# EAGLE design HeatpumpMonitor (EAGLE 6.6.0)
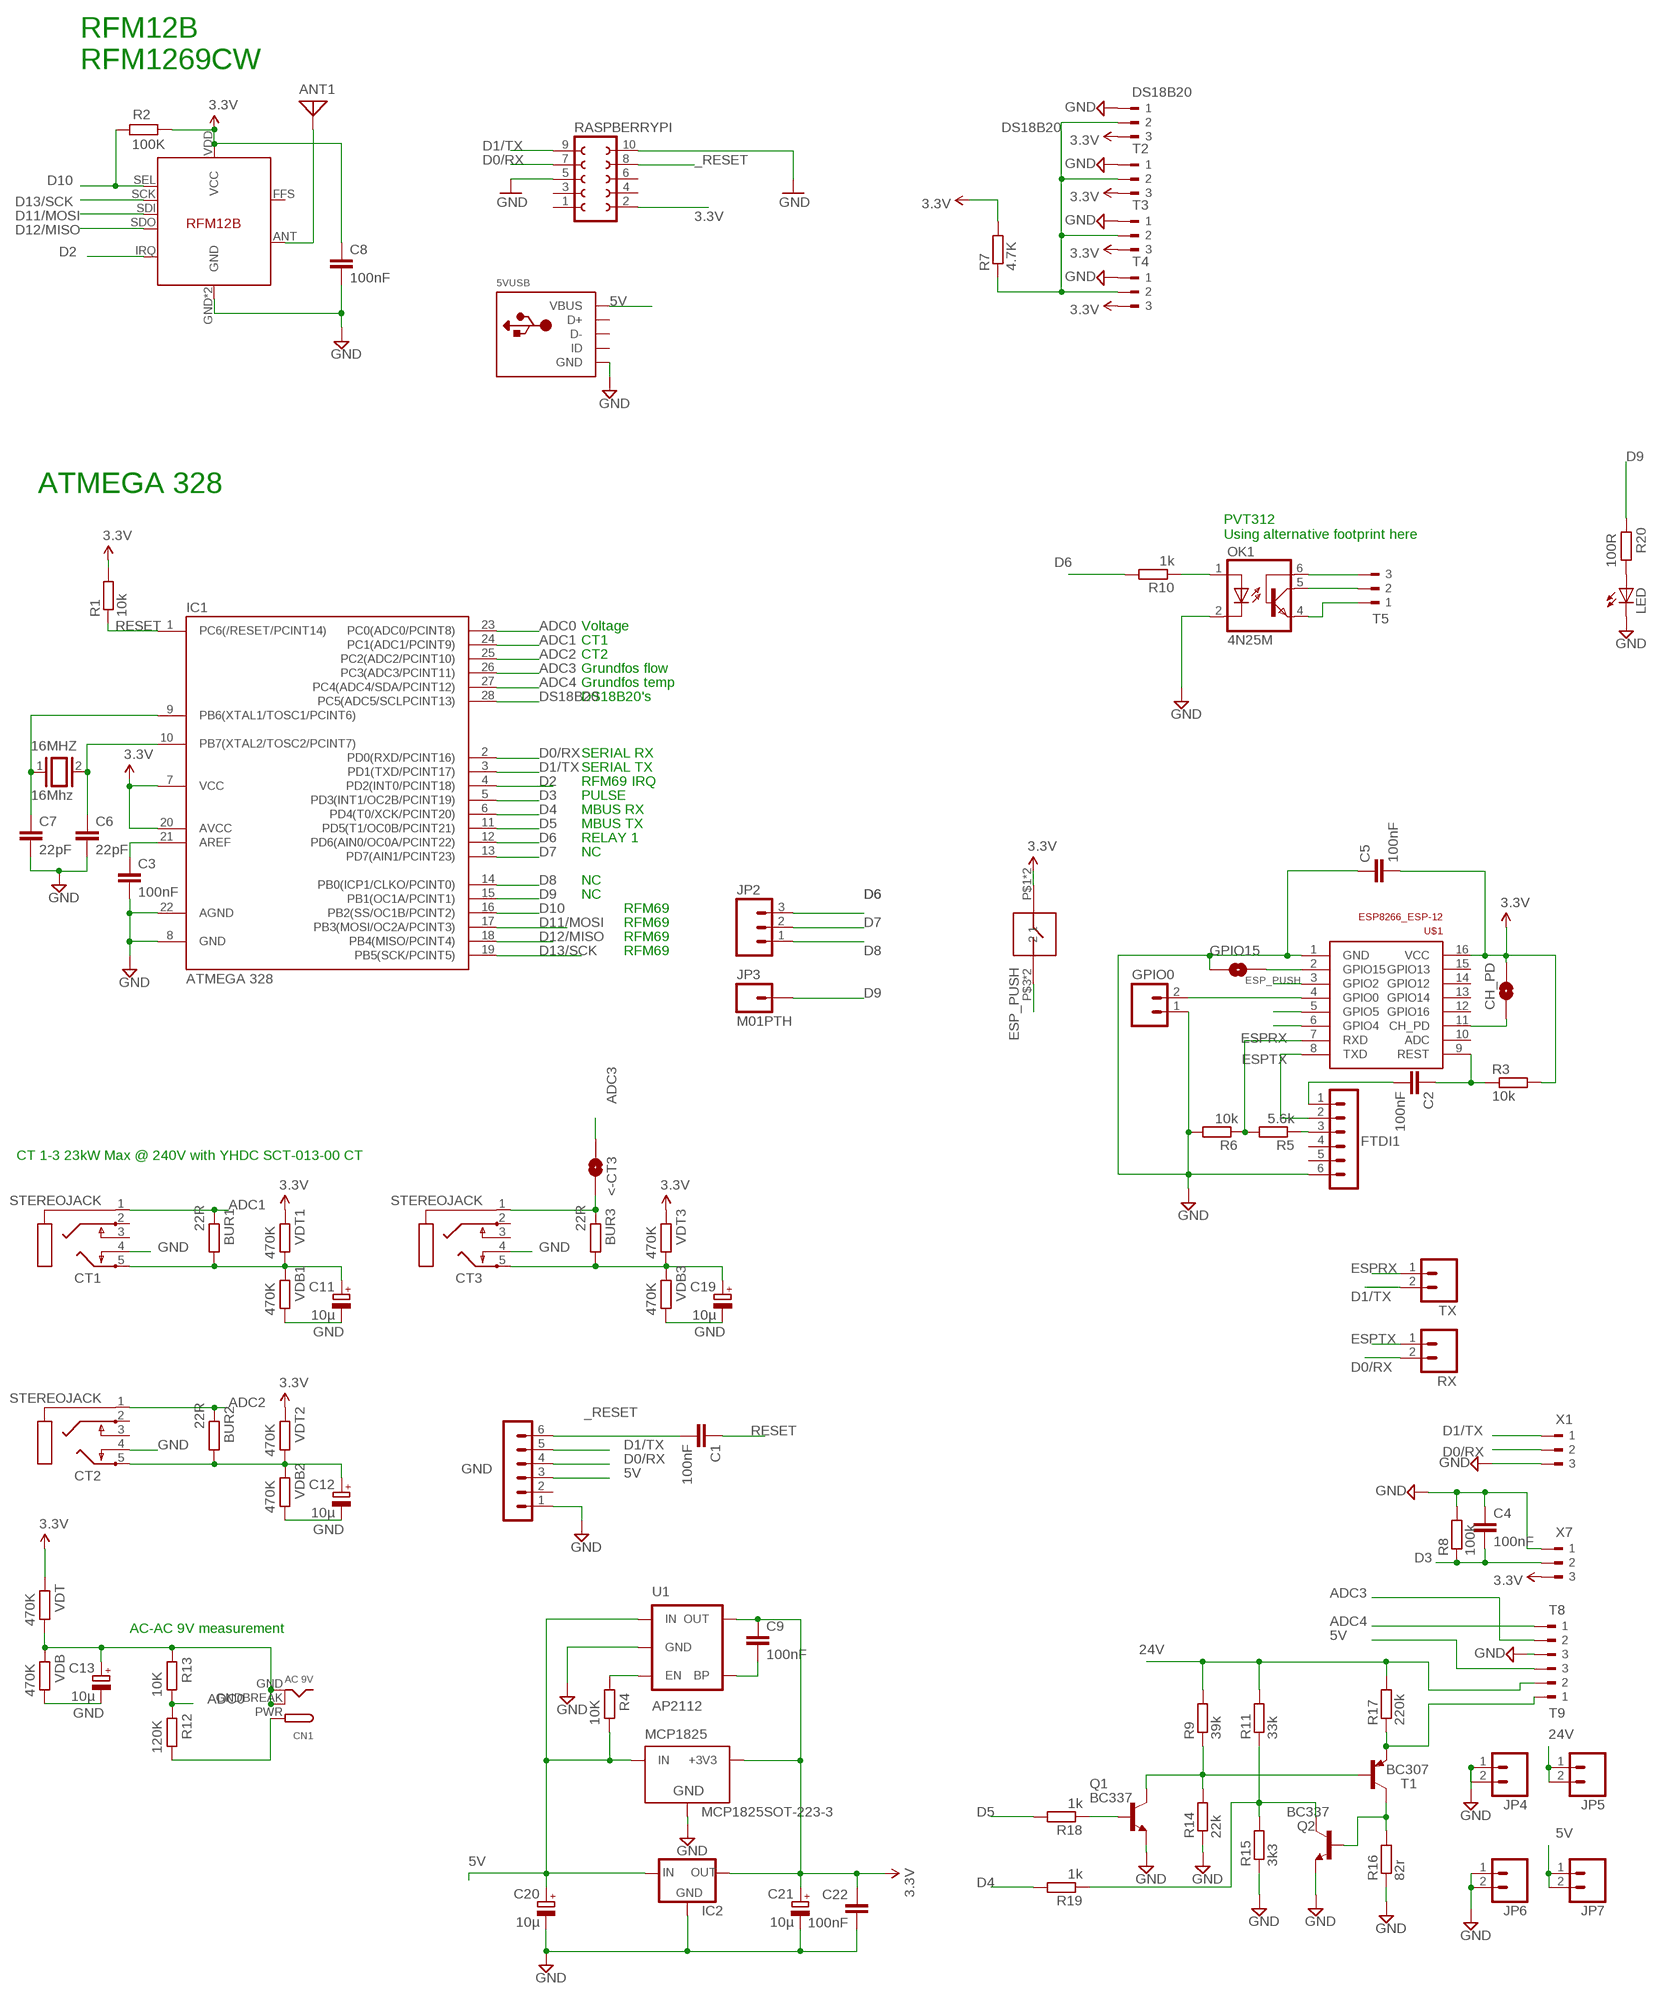
[diagram p0: schematic, sheet 1]

## Parts
5VUSB  USBMOLEX  [USB-MINIB-THM-MOLEX]
16MHZ  16Mhz  XTAL/S  [QS]
<-CT3  SOLDERJUMPERNO  [SJ_2S-NO]
ANT1  ANTENNA  [PAD-01]
BUR1  22R  R-EU_0204/7  [0204/7]
BUR2  22R  R-EU_0204/7  [0204/7]
BUR3  22R  R-EU_0204/7  [0204/7]
C1  100nF  C-EU025-024X044  [C025-024X044]
C2  100nF  C-EU025-024X044  [C025-024X044]
C3  100nF  C-EU025-024X044  [C025-024X044]
C4  100nF  C-EU025-024X044  [C025-024X044]
C5  100nF  C-EU025-024X044  [C025-024X044]
C6  22pF  C2.5/2  [C2.5-2]
C7  22pF  C2.5/2  [C2.5-2]
C8  100nF  C-EU025-024X044  [C025-024X044]
C9  100nF  C-EUC0603  [C0603]
C11  10µ  CPOL-EUE1.8-4  [E1,8-4]
C12  10µ  CPOL-EUE1.8-4  [E1,8-4]
C13  10µ  CPOL-EUE1.8-4  [E1,8-4]
C19  10µ  CPOL-EUE1.8-4  [E1,8-4]
C20  10µ  CPOL-EUE1.8-4  [E1,8-4]
C21  10µ  CPOL-EUE1.8-4  [E1,8-4]
C22  100nF  C-EU025-024X044  [C025-024X044]
CH_PD  SOLDERJUMPERNO  [SJ_2S-NO]
CN1  AC 9V  DCBARRELPTH  [DCJACK_2MM_PTH]
CT1  STEREOJACK  [STX3100]
CT2  STEREOJACK  [STX3100]
CT3  STEREOJACK  [STX3100]
DS18B20  180-3  [180-3]
FTDI1  FTDI  MA06-1  [MA06-1]
GND  FTDI  MA06-1  [MA06-1]
GPIO0  M02PTH  [1X02]
GPIO15  SOLDERJUMPERNO  [SJ_2S-NO]
IC1  ATMEGA 328  ATMEGA48/88/168-PU  [DIL28-3]
IC2  78XXS  [78XXS]
JP2  M03PTH  [1X03]
JP3  M01PTH  [1X01]
JP4  M02PTH  [1X02]
JP5  M02PTH  [1X02]
JP6  M02PTH  [1X02]
JP7  M02PTH  [1X02]
LED  LED3MM  [LED3MM]
MCP1825  MCP1825SOT-223-3  [SOT-223]
OK1  4N25M  [DIL06]
Q1  BC337  [TO92]
Q2  BC337  [TO92]
R1  10k  R-EU_0204/7  [0204/7]
R2  100K  R-EU_0204/7  [0204/7]
R3  10k  R-EU_0204/7  [0204/7]
R4  10K  R-EU_R0603  [R0603]
R5  5.6k  R-EU_0204/7  [0204/7]
R6  10k  R-EU_0204/7  [0204/7]
R7  4.7K  R-EU_0204/7  [0204/7]
R8  100k  R-EU_0207/2V  [0207/2V]
R9  39k  R-EU_0204/7  [0204/7]
R10  1k  R-EU_0204/7  [0204/7]
R11  33k  R-EU_0204/7  [0204/7]
R12  120K  R-EU_0204/7  [0204/7]
R13  10K  R-EU_0204/7  [0204/7]
R14  22k  R-EU_0204/7  [0204/7]
R15  3k3  R-EU_0204/7  [0204/7]
R16  82r  R-EU_0204/7  [0204/7]
R17  220k  R-EU_0204/7  [0204/7]
R18  1k  R-EU_0204/7  [0204/7]
R19  1k  R-EU_0204/7  [0204/7]
R20  100R  R-EU_0204/7  [0204/7]
RASPBERRYPI  FE05-2  [FE05-2]
RX  M02PTH  [1X02]
T1  BC307  [TO92]
T2  180-3  [180-3]
T3  180-3  [180-3]
T4  180-3  [180-3]
T5  180-3  [180-3]
T8  180-3  [180-3]
T9  180-3  [180-3]
TX  M02PTH  [1X02]
U1  AP2112  V_REG_LDOSMD  [SOT23-5]
U$1  ESP8266_ESP-12  [ESP8266-ESP12]
U$2  KSEK43G"  [KSEK43G]
U$14  RFM12B  [RFM12B]
VDB  470K  R-EU_0204/7  [0204/7]
VDB1  470K  R-EU_0204/7  [0204/7]
VDB2  470K  R-EU_0204/7  [0204/7]
VDB3  470K  R-EU_0204/7  [0204/7]
VDT  470K  R-EU_0204/7  [0204/7]
VDT1  470K  R-EU_0204/7  [0204/7]
VDT2  470K  R-EU_0204/7  [0204/7]
VDT3  470K  R-EU_0204/7  [0204/7]
X1  180-3  [180-3]
X7  180-3  [180-3]

## Nets
3.3V: C5.2 C8.1 C9.1 C21.+ C22.1 CH_PD.1 DS18B20.3 IC1.7(VCC) IC1.20(AVCC) IC2.OUT MCP1825.3(+3V3) R1.2 R2.1 R3.2 R7.2 RASPBERRYPI.2 T2.3 T3.3 T4.3 U1.5(OUT) U$1.16(VCC) U$2.P$1 U$2.P$2 U$14.VDD(VCC) VDT1.2 VDT2.2 VDT3.2 VDT.2 X7.3
5V [power]: 5VUSB.VBUS C20.+ GND.3 IC2.IN JP7.1 JP7.2 MCP1825.1(IN) R4.1 T9.3 U1.1(IN)
24V: JP5.1 JP5.2 R9.2 R11.2 R17.2 T9.2
_RESET: C1.2 GND.6 RASPBERRYPI.8
AC: CN1.PWR R12.1
ADC0: IC1.23(PC0(ADC0/PCINT8)) R12.2 R13.1
ADC1: BUR1.2 CT1.1 IC1.24(PC1(ADC1/PCINT9))
ADC2: BUR2.2 CT2.1 IC1.25(PC2(ADC2/PCINT10))
ADC3: <-CT3.2 IC1.26(PC3(ADC3/PCINT11)) T8.2
ADC4: IC1.27(PC4(ADC4/SDA/PCINT12)) T8.1
D0/RX: GND.4 IC1.2(PD0(RXD/PCINT16)) RASPBERRYPI.7 RX.2 X1.2
D1/TX: GND.5 IC1.3(PD1(TXD/PCINT17)) RASPBERRYPI.9 TX.2 X1.1
D2: IC1.4(PD2(INT0/PCINT18)) U$14.IRQ
D3: C4.2 IC1.5(PD3(INT1/OC2B/PCINT19)) R8.1 X7.2
D4: IC1.6(PD4(T0/XCK/PCINT20)) R19.2
D5: IC1.11(PD5(T1/OC0B/PCINT21)) R18.2
D6: IC1.12(PD6(AIN0/OC0A/PCINT22)) JP2.3 R10.2
D7: IC1.13(PD7(AIN1/PCINT23)) JP2.2
D8: IC1.14(PB0(ICP1/CLKO/PCINT0)) JP2.1
D9: IC1.15(PB1(OC1A/PCINT1)) JP3.1 R20.2
D10: IC1.16(PB2(SS/OC1B/PCINT2)) R2.2 U$14.SEL
D11/MOSI: IC1.17(PB3(MOSI/OC2A/PCINT3)) U$14.SDI
D12/MISO: IC1.18(PB4(MISO/PCINT4)) U$14.SDO
D13/SCK: IC1.19(PB5(SCK/PCINT5)) U$14.SCK
DIG1: ANT1.1 U$14.ANT
DS18B20: DS18B20.2 IC1.28(PC5(ADC5/SCLPCINT13)) R7.1 T2.2 T3.2 T4.2
ESP_PUSH: U$1.3(GPIO2) U$2.P$3 U$2.P$4
ESPRX: R5.2 R6.1 TX.1 U$1.7(RXD)
ESPTX: FTDI1.2 RX.1 U$1.8(TXD)
GND [power]: 5VUSB.GND C3.2 C4.1 C5.1 C6.2 C7.2 C8.2 C11.- C12.- C13.- C19.- C20.- C21.- C22.2 CT1.4 CT2.4 CT3.4 DS18B20.1 FTDI1.6 GND.1 GPIO0.1 GPIO15.2 IC1.8(GND) IC1.22(AGND) IC2.GND JP4.1 JP4.2 JP6.1 JP6.2 LED.K(C) MCP1825.2(GND) OK1.2(C) Q1.1(E) Q2.1(E) R6.2 R8.2 R14.1 R15.1 R16.1 RASPBERRYPI.5 RASPBERRYPI.10 T2.1 T3.1 T4.1 T8.3 U1.2(GND) U$1.1(GND) U$14.GND U$14.P$12(GND) VDB1.1 VDB2.1 VDB3.1 VDB.1 X1.3 X7.1
N$1: 16MHZ.2 C6.1 IC1.10(PB7(XTAL2/TOSC2/PCINT7))
N$2: BUR2.1 C12.+ CT2.5 VDB2.2 VDT2.1
N$3: C2.2 FTDI1.1
N$4: <-CT3.1 BUR3.2 CT3.1
N$5: OK1.1(A) R10.1
N$6: OK1.6(BAS) T5.3
N$7: C9.2 U1.4(BP)
N$8: BUR3.1 C19.+ CT3.5 VDB3.2 VDT3.1
N$9: OK1.5(COL) T5.2
N$10: OK1.4(EMI) T5.1
N$11: R4.2 U1.3(EN)
N$12: 16MHZ.1 C7.1 IC1.9(PB6(XTAL1/TOSC1/PCINT6))
N$13: R17.1 T1.1(E) T9.1
N$14: U$1.5(GPIO5)
N$15: LED.A R20.1
N$16: Q2.2(B) R16.2 T1.3(C)
N$17: U$1.6(GPIO4)
N$18: Q1.3(C) R9.1 R14.2 T1.2(B)
N$19: C3.1 IC1.21(AREF)
N$21: Q2.3(C) R11.1 R15.2 R19.1
N$25: Q1.2(B) R18.1
N$26: GPIO15.1 U$1.2(GPIO15)
N$29: GPIO0.2 U$1.4(GPIO0)
N$34: C13.+ CN1.GND CN1.GNDBREAK R13.2 VDB.2 VDT.1
N$36: FTDI1.3 R5.1
N$38: BUR1.1 C11.+ CT1.5 VDB1.2 VDT1.1
N$39: CH_PD.2 U$1.11(CH_PD)
N$40: C2.1 R3.1 U$1.9(REST)
RESET: C1.1 IC1.1(PC6(/RESET/PCINT14)) R1.1
Unconnected: 5VUSB.D+ 5VUSB.D- 5VUSB.ID CT1.2 CT1.3 CT2.2 CT2.3 CT3.2 CT3.3 FTDI1.4 FTDI1.5 GND.2 RASPBERRYPI.1 RASPBERRYPI.3 RASPBERRYPI.4 RASPBERRYPI.6 U$1.10(ADC) U$1.12(GPIO16) U$1.13(GPIO14) U$1.14(GPIO12) U$1.15(GPIO13) U$14.FFS

## Notes on the sheet
- RFM12B
  RFM1269CW
- ATMEGA 328
- PVT312
  Using alternative footprint here
- Voltage
- CT1
- CT2
- Grundfos flow
- Grundfos temp
- DS18B20's
- SERIAL RX
- SERIAL TX
- RFM69 IRQ
- PULSE
- MBUS RX
- MBUS TX
- RELAY 1
- NC
- NC
- NC
- RFM69
- RFM69
- RFM69
- RFM69
- CT 1-3 23kW Max @ 240V with YHDC SCT-013-00 CT
- AC-AC 9V measurement

## Library data of the parts
5VUSB = adafruit:USB: USB Connectors USBMINIB - Surface Mount Female Mini-B USB Connector 4UConnector: 06564 By microbuilder.eu Thru-hole RA Female Mini-B USB Connector 4UConnector: 18732 By ladyada.net
16MHZ = special:XTAL/S: CRYSTAL
<-CT3 CH_PD GPIO15 = SparkFun:SOLDERJUMPER: Solder Jumper Standard SMD solder jumper. Used to automate production. Two varients : Normally Open and Normally Closed are the same, but have different paste layers. NC will have a large amount of paste and should jumper during reflow.
ANT1 = discrete:ANTENNA: Antenna
BUR1-BUR3 R2-R6 R8 R10 R12 R13 R20 VDB VDB1-VDB3 VDT VDT1-VDT3 = rcl:R-EU_: RESISTOR, European symbol
C1-C5 C8 C9 C22 = resistor:C-EU: CAPACITOR, European symbol
C6 C7 = capacitor-wima:C: CAPACITOR naming: grid - package width
C11-C13 C19-C21 = resistor:CPOL-EU: POLARIZED CAPACITOR, European symbol
CN1 = adafruit:DCBARREL: 2.0mm DC Barrel Jack DCJACK_2MM_PTH - Through Hole Jack (4UConnector: 05537)
CT1-CT3 = adafruit:STEREOJACK: MIC/HEADPHONE JACK Stereo jack with two switches. Kycon STX3100, CUI SJ1-3555NG and/or 4UCon 05544
DS18B20 T2-T5 T8 T9 X1 X7 = con-weidmueller-sl35:180-3: WEIDMUELLER CLAMP CONNECTOR; OC_FARNELL: unknown; OC_NEWARK: unknown
FTDI1 GND = JeeLabs:MA06-1: PIN HEADER
GPIO0 JP4-JP7 RX TX = SparkFun:M02: Header 2 Standard 2-pin 0.1" header. Use with straight break away headers (SKU : PRT-00116), right angle break away headers (PRT-00553), swiss pins (PRT-00743), machine pins (PRT-00117), and female headers (PRT-00115). Molex polarized connector foot print use with SKU : PRT-08233 with associated crimp pins and housings.
IC1 = atmega8:ATMEGA48/88/168-PU
IC2 = v-reg:78XXS: VOLTAGE REGULATOR
JP2 = SparkFun:M03: Header 3 Standard 3-pin 0.1" header. Use with straight break away headers (SKU : PRT-00116), right angle break away headers (PRT-00553), swiss pins (PRT-00743), machine pins (PRT-00117), and female headers (PRT-00115). Molex polarized connector foot print use with SKU : PRT-08232 with associated crimp pins and housings.
JP3 = SparkFun:M01: Header 1 Standard 1-pin 0.1" header. Use with straight break away headers (SKU : PRT-00116), right angle break away headers (PRT-00553), swiss pins (PRT-00743), machine pins (PRT-00117), and female headers (PRT-00115).
LED = adafruit:LED: LED OSRAM: - CHIPLED LG R971, LG N971, LY N971, LG Q971, LY Q971, LO R971, LY R971 LH N974, LH R974 LS Q976, LO Q976, LY Q976 LO Q996 - Hyper CHIPLED LW Q18S LB Q993, LB Q99A, LB R99A - SideLED LS A670, LO A670, LY A670, LG A670, LP A670 LB A673, LV A673, LT A673, LW A673 LH A674 LY A675 LS A676, LA A676, LO A676, LY A676, LW A676 LS A679, LY A679, LG A679 - Hyper Micro SIDELED® LS Y876, LA Y876, LO Y876, LY Y876 LT Y87S - SmartLED LW L88C, LW L88S LB L89C, LB L89S, LG L890 LS L89K, LO L89K, LY L89K LS L896, LA L896, LO L896, LY L896 - TOPLED LS T670, LO T670, LY T670, LG T670, LP T670 LSG T670, LSP T670, LSY T670, LOP T670, LYG T670 LG T671, LOG T671, LSG T671 LB T673, LV T673, LT T673, LW T673 LH T674 LS T676, LA T676, LO T676, LY T676, LB T676, LH T676, LSB T676, LW T676 LB T67C, LV T67C, LT T67C, LS T67K, LO T67K, LY T67K, LW E67C LS E67B, LA E67B, LO E67B, LY E67B, LB E67C, LV E67C, LT E67C LW T67C LS T679, LY T679, LG T679 LS T770, LO T770, LY T770, LG T770, LP T770 LB T773, LV T773, LT T773, LW T773 LH T774 LS E675, LA E675, LY E675, LS T675 LS T776, LA T776, LO T776, LY T776, LB T776 LHGB T686 LT T68C, LB T68C - Hyper Mini TOPLED® LB M676 - Mini TOPLED Santana® LG M470 LS M47K, LO M47K, LY M47K Source: http://www.osram.convergy.de/
MCP1825 = SteelCaveRobotics-Power:MCP1825: MCP1825 3.3v LDO Linear Regulator
OK1 = optocoupler:4N*?M: General Purpose 6-Pin Phototransistor Optocouplers Source: http://www.fairchildsemi.com/ds/4N/4N35-M.pdf; MPN: 4N25-M; OC_FARNELL: 1021349; OC_NEWARK: 98K9084
Q1 Q2 = transistor:BC337: NPN TRANSISTOR
R1 R7 R9 R11 R14-R19 = resistor:R-EU_: RESISTOR, European symbol
RASPBERRYPI = con-lsta:FE05-2: FEMALE HEADER; OC_FARNELL: unknown; OC_NEWARK: unknown
T1 = transistor-pnp:BC307: PNP Transistor
U1 = SparkFun:V_REG_LDO: Voltage Regulator LDO Standard 150mA LDO voltage regulator in SOT-23 layout. Micrel part MIC5205. BP (by-pass) pin is used to lower output noise with 470pF cap.
U$1 = ESP8266-ESP12:ESP8266_ESP-12
U$2 = KSEM43G Tactile Switch:KSEK43G; TYPE: TACTILE PUSH SWITCH
U$14 = JeeParts:RFM12B

## Net classes
0 default: width 0.203 mm, drill 0.6 mm, clearance 0.203 mm
1 power: width 0.381 mm, drill 0.6 mm, clearance 0.254 mm
2 gnd: width 0.254 mm, drill 0.6 mm, clearance 0.254 mm

## Board
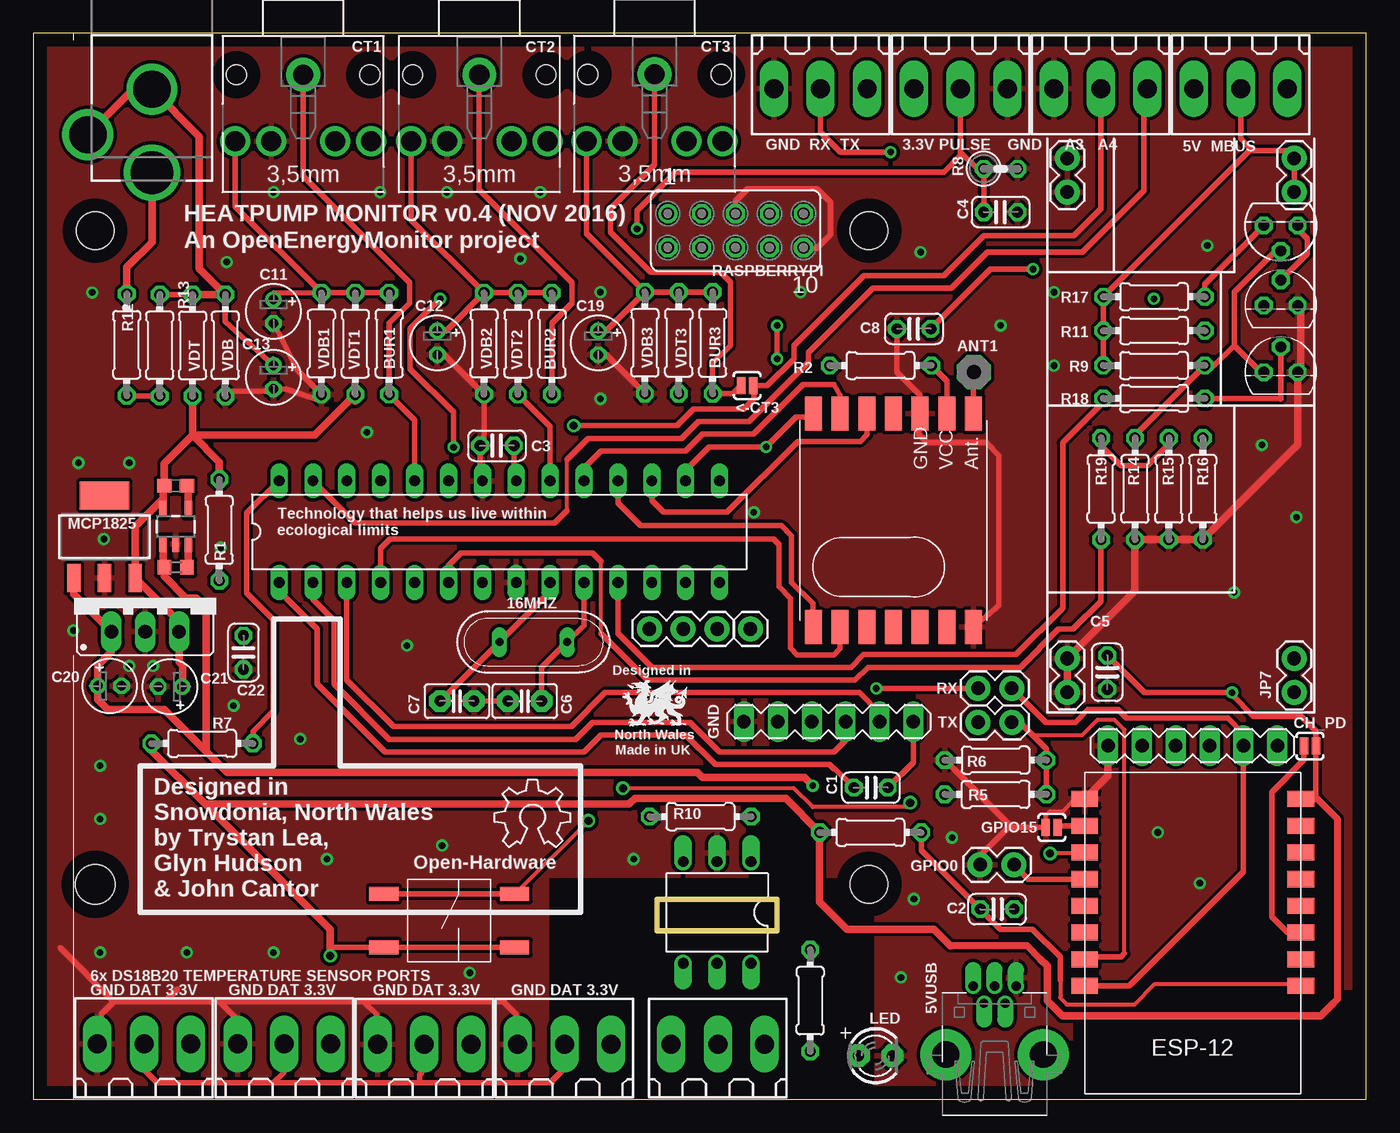
[diagram p1: board, top side]
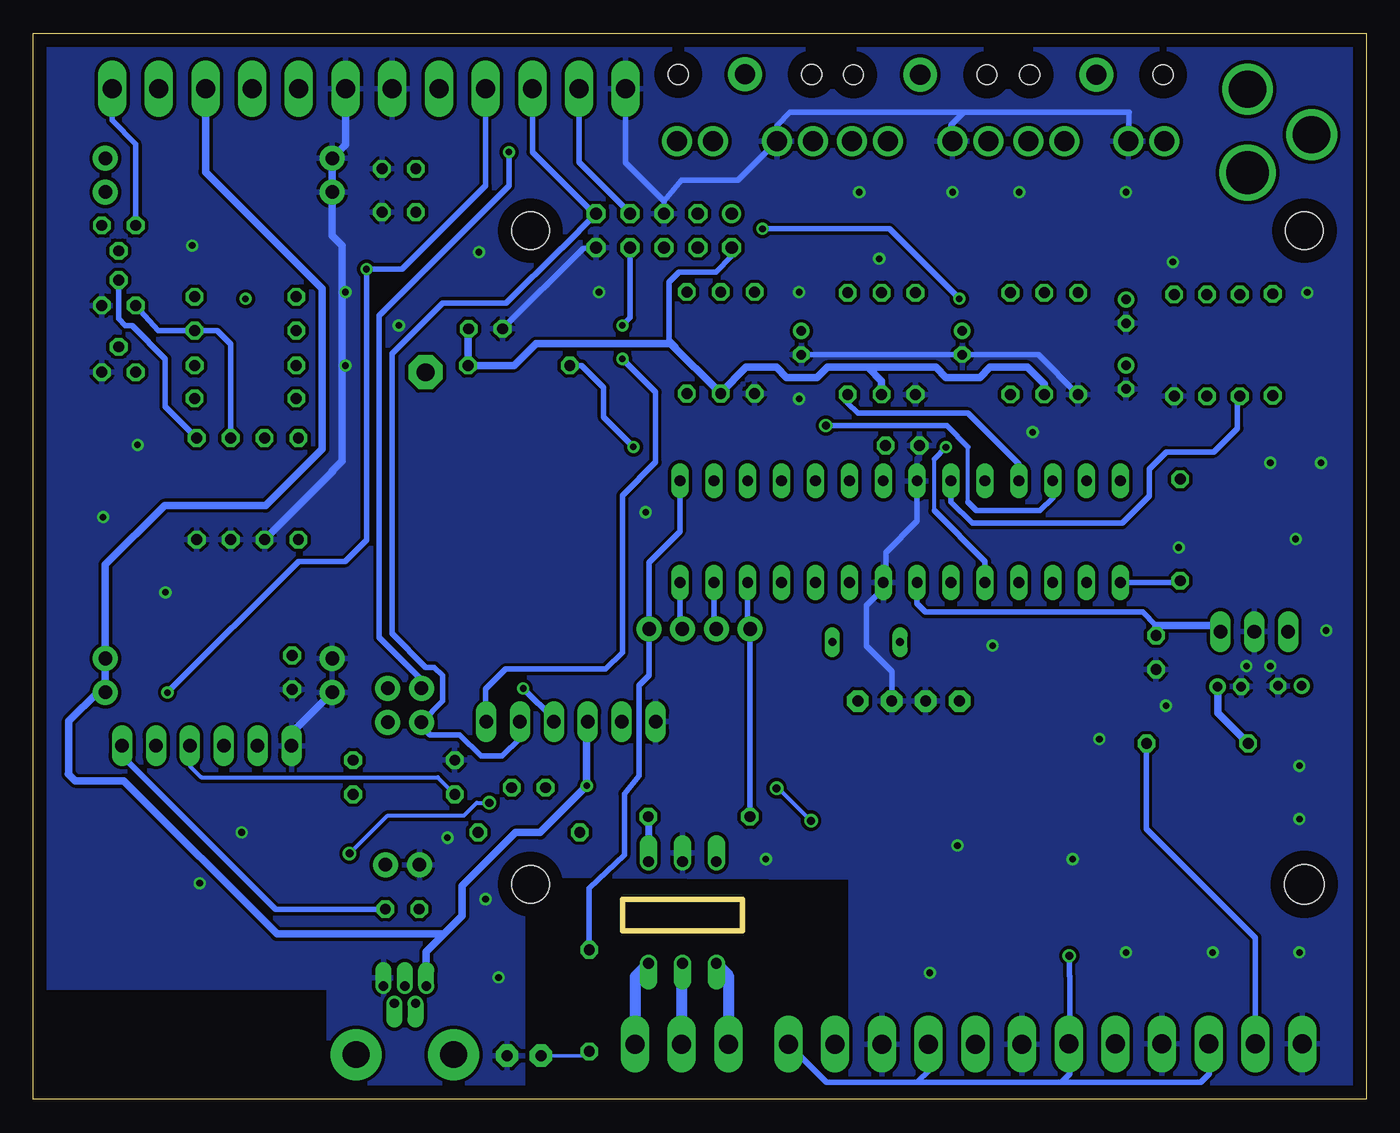
[diagram p2: board, bottom side, seen from below]

Size 99.9 x 79.9 mm. Coordinates in mm from the lower left corner, seen from the top.
Outline: 99.9,0 99.9,79.9 0,79.9 0,0 99.9,0
Copper layers (1*16): Top 0.035mm / dielectric 1.5mm / Bottom 0.035mm
Design rules "default *": minimum track width 10mil, minimum drill 24mil, track to track 8mil, track to pad 8mil, pad to pad 8mil, via to via 8mil, smd to smd 8mil, copper to edge 40mil, drill to drill 8mil, minimum pad ring 10mil, minimum via ring 8mil, stop-mask expansion 0.075mm, vias tented up to drill 0.6mm, thermal gap 10mil
Holes 2.8 mm at 62.63,16.11 62.63,65.11 4.63,65.11
Holes 3 mm at 4.63,16.11
Milling: 5 lines

### Footprints (pad centres in the part's own frame; a part is rotated, then mirrored left to right if it is on the bottom)
USB-MINIB-THM-MOLEX = drill 0.7 offset: D+ 0,9.72; D- -0.8,8.42; GND 1.6,9.72; ID 0.8,8.42; VBUS -1.6,9.72 | drill 2 pad 3.81: GND1 -3.65,4.57; GND4 3.65,4.57
QS = drill 0.61 long: 1 -2.54,0; 2 2.54,0
SJ_2S-NO = smd 0.635 x 1.27: 1 -0.45,0; 2 0.45,0
PAD-01 = drill 1.321 pad 2.54 octagon: 1 0,0
0204/7 = drill 0.813 octagon: 1 -3.81,0; 2 3.81,0
C025-024X044 = drill 0.813 octagon: 1 -1.27,0; 2 1.27,0
C2.5-2 = drill 0.813 pad 1.6 octagon: 1 -1.27,0; 2 1.27,0
C0603 = smd 1.1 x 1: 1 -0.85,0; 2 0.85,0
E1,8-4 = drill 0.711 pad 1.168: + -0.889,0 | drill 0.711 pad 1.168 octagon: - 0.889,0
DCJACK_2MM_PTH = drill 2.8: GND 0,7.35; GNDBREAK 4.8,10.75 | drill 3.2: PWR 0,13.6
STX3100 = drill 1.5 pad 2.54: 1 2.7,-0.1 | drill 1.5: 2 7.7,5; 3 7.7,2.3; 4 7.7,-2.5; 5 7.7,-5.2 | hole 1.5: 2.7,4.9; 2.7,-5.1
180-3 = drill 1.422 long: 1 -3.5,0; 2 0,0; 3 3.5,0
MA06-1 = drill 1.016 long: 1 0,0; 2 2.54,0; 3 5.08,0; 4 7.62,0; 5 10.16,0; 6 12.7,0
1X02 = drill 1.016 pad 1.88: 1 0,0; 2 2.54,0
DIL28-3 = drill 0.813 long: 1 -16.51,-3.81; 2 -13.97,-3.81; 3 -11.43,-3.81; 4 -8.89,-3.81; 5 -6.35,-3.81; 6 -3.81,-3.81; 7 -1.27,-3.81; 8 1.27,-3.81; 9 3.81,-3.81; 10 6.35,-3.81; 11 8.89,-3.81; 12 11.43,-3.81; 13 13.97,-3.81; 14 16.51,-3.81; 15 16.51,3.81; 16 13.97,3.81; 17 11.43,3.81; 18 8.89,3.81; 19 6.35,3.81; 20 3.81,3.81; 21 1.27,3.81; 22 -1.27,3.81; 23 -3.81,3.81; 24 -6.35,3.81; 25 -8.89,3.81; 26 -11.43,3.81; 27 -13.97,3.81; 28 -16.51,3.81
78XXS = drill 1.016 long: GND 0,-2.54; IN -2.54,-2.54; OUT 2.54,-2.54
1X03 = drill 1.016 pad 1.88: 1 0,0; 2 2.54,0; 3 5.08,0
1X01 = drill 1.016 pad 1.88: 1 0,0
LED3MM = drill 0.813 pad 1.676 octagon: A -1.27,0; K 1.27,0
SOT-223 = smd 1 x 2.1: 1 -2.3,-3.1; 2 0,-3.1; 3 2.3,-3.1 | smd 3.7 x 2.1: 4 0,3.1
DIL06 = drill 0.813 offset: 1 -2.54,-3.81; 2 0,-3.81; 3 2.54,-3.81; 4 2.54,3.81; 5 0,3.81; 6 -2.54,3.81
TO92 = drill 0.813 octagon: 1 1.27,0; 2 0,1.905; 3 -1.27,0
R0603 = smd 1 x 1.1: 1 -0.85,0; 2 0.85,0
0207/2V = drill 0.813 octagon: 1 -1.27,0; 2 1.27,0
FE05-2 = drill 0.914: 1 -5.08,1.27 | drill 0.914 octagon: 2 -5.08,-1.27; 3 -2.54,1.27; 4 -2.54,-1.27; 5 0,1.27; 6 0,-1.27; 7 2.54,1.27; 8 2.54,-1.27; 9 5.08,1.27; 10 5.08,-1.27
SOT23-5 = smd 0.55 x 1.2: 1 -0.95,-1.3; 2 0,-1.3; 3 0.95,-1.3; 4 0.95,1.3; 5 -0.95,1.3
ESP8266-ESP12 = smd 2 x 1.2: 1 16.2,2; 2 16.2,4; 3 16.2,6; 4 16.2,8; 5 16.2,10; 6 16.2,12; 7 16.2,14; 8 16.2,16; 9 0,16; 10 0,14; 11 0,12; 12 0,10; 13 0,8; 14 0,6; 15 0,4; 16 0,2
KSEK43G = smd 2.184 x 1.067: P$1 8,1.1; P$2 -1.8,1.1; P$3 -1.8,5.1; P$4 8,5.1
RFM12B = smd 2.54 x 1.27: ANT 8,-6; FFS -8,2; GND 8,-2; IRQ -8,4; P$8 -8,0; P$9 -8,-2; P$10 -8,-4; P$12 -8,-6; P$16 8,0; SCK 8,4; SDI 8,2; SDO -8,6; SEL 8,6; VDD 8,-4

### Placement (x,y rotation side)
5VUSB  72.05,-1.23 0 top
16MHZ  37.48,34.27 0 top
<-CT3  53.5,53.5 0 top
ANT1  70.5,54.5 270 top
BUR1  26.67,56.64 270 top
BUR2  38.86,56.64 270 top
BUR3  50.91,56.7 270 top
C1  62.78,23.36 0 top
C2  72.25,14.25 0 top
C3  34.75,49 180 top
C4  72.5,66.5 180 top
C5  80.5,32 90 top
C6  36.83,29.84 180 top
C7  31.75,29.84 0 top
C8  66,57.75 180 top
C9  10.67,45.97 0 top
C11  18,59.06 270 top
C12  30.28,56.7 270 top
C13  18,54.12 270 top
C19  42.34,56.7 270 top
C20  5.72,30.98 0 top
C21  10.25,30.93 180 top
C22  15.75,33.49 270 top
CH_PD  95.69,26.47 180 top
CN1  8.89,83.06 180 top
CT1  20.32,79.5 270 top
CT2  33.53,79.5 270 top
CT3  46.66,79.53 270 top
DS18B20  8.3,4.15 0 top
FTDI1  93.25,26.5 180 top
GND  53.26,28.3 0 top
GPIO0  70.96,17.58 0 top
GPIO15  76.34,20.38 180 top
IC1  34.92,42.55 0 top
IC2  8.38,37.59 0 top
JP2  51.25,35.25 180 top
JP3  53.75,35.25 0 top
JP4  77.5,68 90 top
JP5  94.5,68 90 top
JP6  77.5,30.5 90 top
JP7  94.5,30.5 90 top
LED  63.12,3.26 0 top
LOGO1  OSHW_LOGO_6MILX0200-NT  [OSHW_6X200_NOTEXT]  34.58,18.88 0 top
MCP1825  5.33,42.16 0 top
OK1  51.25,14 180 top
Q1  93.5,54.5 0 top
Q2  93.5,59.5 0 top
R1  13.94,42.67 90 top
R2  63.5,55 180 top
R3  62.75,20 180 top
R4  10.67,39.88 0 top
R5  72.12,22.85 0 top
R6  72.12,25.42 180 top
R7  12.65,26.67 180 top
R8  72.5,69.75 0 top
R9  84,55 180 top
R10  50,21.18 180 top
R11  84,57.62 180 top
R12  7,56.56 270 top
R13  9.47,56.51 90 top
R14  82.58,45.76 90 top
R15  85.11,45.76 90 top
R16  87.66,45.76 90 top
R17  84,60.16 180 top
R18  84,52.53 180 top
R19  80.03,45.76 270 top
R20  58.23,7.39 90 top
RASPBERRYPI  52.63,65.11 0 top
RX  73.34,30.8 180 top
T1  93.5,65.5 180 top
T2  18.8,4.15 0 top
T3  29.3,4.13 0 top
T4  39.8,4.13 0 top
T5  51.3,4.13 0 top
T8  80,75.75 180 top
T9  90.5,75.75 180 top
TX  73.34,28.26 180 top
U1  10.67,42.93 0 top
U$1  95,24.5 180 top
U$2  28.07,10.29 0 top
U$14  64.47,43.39 90 top
VDB  14.39,56.51 90 top
VDB1  21.59,56.64 90 top
VDB2  33.78,56.64 90 top
VDB3  45.84,56.7 90 top
VDT  11.93,56.51 270 top
VDT1  24.13,56.64 270 top
VDT2  36.32,56.64 270 top
VDT3  48.38,56.7 270 top
X1  59,75.75 180 top
X7  69.5,75.75 180 top

### Tracks (layer width: path | path; a pad name or v marks a point on that pad's centre or on a via)
3.3V  (via drill 0.5, 0.6)
  Top 0.406: U$1.16 arc-90 U$1.16 95,22.61 94.74,22.61 | 95.24,22.74 U$1.16 | VDT2.2 38.73,50.42 IC1.20 | R2.1 68.47,53.84 U$14.VDD 68.54,51.08 68.58,51.12 | C8.1 71.75,62.23 v74.93,62.23 74.93,62.3 | U$1.16 95.25,22.5 95.5,22.25 95.77,22.25 96.14,22.61 CH_PD.1 96.14,27.61 95.05,28.7 91.44,28.7 89.85,30.29 v89.85,30.48 83.29,30.48 C5.2 | 58.75,20 R3.2 | 22.25,11.39 U$2.P$2 U$2.P$1
  Top 0.508: 96.14,22.61 97.75,21 97.75,7.5 97.44,7.19 | 75.5,10.5 74.5,11.5 68.75,11.5
  Top 0.559: 12.88,22.12 8.84,26.16 R7.2 | 12.88,22.12 22.25,12.75 22.25,11.39 v22.25,10.75 | 68.75,11.5 67.5,12.75 61,12.75 58.94,14.81 R3.2 56.4,22.54 45.09,22.54 44.67,22.12 12.88,22.12 | 75.5,10.5 76,10 76,7.38 77.12,6.25 96.5,6.25 97.44,7.19 | U1.5 9.72,45.02 | 9.72,45.02 9.72,45.87 C9.1 9.82,47.66 11.93,49.78 | 9.72,45.02 7.63,42.94 MCP1825.3 10.92,35.78 IC2.OUT 10.92,32.77 11.18,32.51 11.18,30.71 C21.+ | 24.13,52.32 VDT1.2 21.07,49.78 11.93,49.78 | VDT.2 11.93,49.78 | R1.2 13.94,47.77 11.93,49.78
  Bottom 0.406: DS18B20.3 11.75,4.1 11.75,1.91 12.38,1.27 22.86,1.27 | 22.86,1.27 33.66,1.27 | 22.86,1.27 22.23,1.91 22.23,4.08 T2.3 22.23,4.22 22.23,9.21 22.25,9.23 v22.25,10.75 | T3.3 32.7,4.03 32.7,2.22 33.66,1.27 | 36.32,53.47 VDT2.2 | C8.1 67.31,57.71 | v89.85,30.48 80.01,40.32 76.52,40.32 74.93,41.91 v74.93,62.23 72.25,62.23 66,68.48 X7.3 | IC1.7 33.66,37.15 33.02,36.51 16.74,36.51 15.75,35.52 C22.1 | 52.25,56.77 52.25,61.25 51.5,62 48.75,62 47.55,63.2 RASPBERRYPI.2 | 33.66,1.27 40.44,1.27 T4.3
  Bottom 0.559: VDT1.2 24.13,53.59 25.4,54.86 28.19,54.86 28.96,54.1 31.5,54.1 32.26,54.86 37.34,54.86 | 67.31,57.71 R2.1 63.87,55 62.23,56.64 52.07,56.64 | 9.14,26.67 R7.2 11.14,28.97 C21.+ | 15.75,35.52 11.39,35.52 IC2.OUT | 37.34,54.86 40.39,54.86 41.15,54.1 43.43,54.1 44.2,54.86 46.48,54.86 48.38,52.97 VDT3.2 52.25,56.77 | 36.32,53.47 36.32,53.85 37.34,54.86 | 52.18,56.75 52.07,56.64 | 52.07,56.64 51.82,56.39
5V  (via drill 0.5)
  Top 0.406: v58.42,23.5 58.1,23.81
  Top 0.559: MCP1825.1 3.03,37.86 IC2.IN 5.84,33.53 4.83,32.51 C20.+ 4.83,30.73 4.83,29.97 5.59,29.21 9.8,29.21 12.95,26.06 | 12.95,26.06 12.95,36.83 12.19,37.59 11.43,37.59 9.82,39.2 R4.1 9.72,39.98 U1.1 | 12.95,26.06 14.51,24.5 49.8,24.5 50.16,24.13 57.78,24.13 v58.42,23.5
  Bottom 0.406: GND.3 58.42,28.23
  Bottom 0.559: 58.42,28.23 v58.42,23.5 61.91,20 63.75,20 67.75,16 67.75,13.75 69.12,12.38 | T9.3 87,69.5 78.25,60.75 78.25,48.75 82.5,44.5 90.07,44.5 94.5,40.07 JP7.2 JP7.1 95.08,30.5 97.23,28.35 97.23,24.43 97.28,24.38 96.77,23.88 93.13,23.88 81.63,12.38 69.12,12.38 | 69.12,12.38 70.45,11.05 5VUSB.VBUS
24V
  Top 0.406: R9.2 R11.2 R17.2 91.16,71.11 91.38,71.11 | JP5.1 JP5.2 93.92,71.11 91.38,71.11 | 91.38,71.11 90.5,71.99 T9.2
_RESET  (via drill 0.5)
  Top 0.406: GND.6 65.95,25.26 C1.2 | v55.75,55.5 v55.75,58
  Bottom 0.406: GND.6 66,28.34 66,30.75 64.5,32.25 57,32.25 55.75,33.5 55.75,45.25 53.25,47.75 53.25,53 v55.75,55.5 | v55.75,58 55.17,58.58 RASPBERRYPI.8
AC
  Top 0.559: CN1.PWR 8.89,64.26 7,62.37 R12.1
ADC0
  Top 0.406: R12.2 7.04,52.7 R13.1 9.39,52.7 9.25,52.56
  Bottom 0.406: 9.53,52.65 R13.1 9.65,52.52 9.65,50.29 11.43,48.51 14.99,48.51 16.26,47.24 16.26,45.21 18.29,43.18 29.53,43.18 31.11,44.77 IC1.23 31.11,45.4
ADC1
  Top 0.406: CT1.1 20.22,69.19 28.19,61.21 28.19,59.69 26.67,58.17 BUR1.2 28.57,50.93 IC1.24
ADC2
  Top 0.406: BUR2.2 38.86,58.17 40.39,59.69 40.39,61.21 33.43,68.17 CT2.1
  Bottom 0.406: IC1.25 26.04,47.62 29.84,51.44 38.1,51.44 38.86,52.2 BUR2.2 38.86,52.51
ADC3  (via drill 0.6)
  Top 0.406: T8.2 80,66.75 78,64.75 71.25,64.75 68.25,61.75 62.25,61.75 57,56.5 57,55.5 55,53.5 <-CT3.2 54,53.45 54,52.5 53.25,51.75 49.5,51.75 48.23,50.48 48.22,50.5 v40.5,50.5
  Bottom 0.305: 29.84,44.77 29.84,48.9
  Bottom 0.406: IC1.26 23.5,45.09 24.45,44.13 29.21,44.13 29.84,44.77 | 29.84,48.9 31.43,50.48 39.69,50.48 39.7,50.5 v40.5,50.5
ADC4
  Top 0.305: 40.01,44.13 40.01,47.94
  Top 0.406: IC1.27 24.13,43.18 39.05,43.18 40.01,44.13 | 40.01,47.94 41.59,49.53 48.58,49.53 49.85,50.8 53.66,50.8 58.1,55.24 58.1,55.97 62.94,60.81 68.81,60.81 71.5,63.5 78.62,63.5 83.25,68.12 83.25,74.89 83.5,75.14 T8.1
D0/RX  (via drill 0.5)
  Top 0.406: IC1.2 20.95,37.47 22.54,35.88 22.54,31.11 26.67,26.99 40.64,26.99 41.91,28.26 49.21,28.26 51.44,26.04 60.01,26.04 60.88,26.91 60.88,27.3 GND.4 | RX.2 v63.18,30.8 | X1.2 59,72.5 60.5,71 v64.25,71
  Bottom 0.406: 60.88,28.82 GND.4 60.88,28.5 v63.18,30.8 | RX.2 70.8,31.43 73.98,34.61 73.98,58.74 64.25,68.47 v64.25,71 | RASPBERRYPI.7 55.17,66.42 59,70.25 X1.2
D1/TX
  Top 0.406: IC1.3 23.5,31.43 26.99,27.94 40.32,27.94 42.86,30.48 61.91,30.48 63.42,28.97 GND.5
  Bottom 0.406: GND.5 63.42,27.07 64.77,25.72 66.36,25.72 67.94,27.3 70.17,27.3 70.8,27.94 TX.2 69.22,29.84 69.22,31.75 69.85,32.38 70.48,32.38 73.03,34.92 73.03,55.88 69.22,59.69 64.45,59.69 60.33,63.82 60.28,63.82 RASPBERRYPI.9 57.88,66.38 62.5,71 X1.1
D2
  Top 0.406: U$14.IRQ 60.47,33.78 60,33.32 57.25,33.32 56.75,33.82 56.75,37.55 55.88,38.42 55.88,41.59 55.47,42 26.75,42 26.04,41.28 IC1.4
D3  (via drill 0.5)
  Top 0.406: v31.5,48.88 31.5,51.5 28.25,54.75 28.25,57.75 v30.5,60 | v45.25,65.25 45.25,66.62 48.12,69.5 68.25,69.5 69.5,70.75 69.5,71 | 69.5,71 X7.2 | C4.2 R8.1 70.75,69.75 69.5,71
  Bottom 0.305: 32.38,44.12 32.38,48
  Bottom 0.406: IC1.5 28.57,40.33 32.38,44.12 | 32.38,48 v31.5,48.88 | v45.25,65.25 35.75,65.25 v30.5,60
D4
  Top 0.305: 42.55,34.92 42.55,40.32
  Top 0.406: IC1.6 31.11,40.01 32.07,40.96 41.91,40.96 42.55,40.32 | R19.2 80.01,41.92 80.01,37.33 77.92,35.24 76.83,35.24 73.98,32.38 62.55,32.38 61.59,31.43 46.04,31.43 42.55,34.92
D5
  Top 0.406: 80.5,52.5 80.23,52.5 R18.2 80.19,52.26 77.15,49.21 77.15,36.83 73.66,33.34 62.23,33.34 61.28,32.38 46.35,32.38 43.81,34.92 IC1.11
D6
  Bottom 0.406: IC1.12 46.35,35.44 JP2.3 46.17,21.52 R10.2
D7
  Bottom 0.406: IC1.13 48.9,35.44 JP2.2
D8
  Bottom 0.406: IC1.14 51.44,35.44 JP2.1
D9
  Bottom 0.406: IC1.15 51.44,42.56 53.75,40.25 JP3.1 53.75,31.75 54.5,31 54.5,24.25 55.59,22.9 55.59,18.3 58.23,15.79 R20.2
D10  (via drill 0.5)
  Top 0.406: U$14.SEL 58.42,51.12 57.15,51.12 v54.93,48.9 50.65,48.9 48.9,47.15 IC1.16
  Bottom 0.406: 59.62,54.93 R2.2 58.81,55 57.15,53.34 57.15,51.12 v54.93,48.9
D11/MOSI
  Top 0.406: U$14.SDI 62.5,51.04 62.5,49.82 62,49.32 57.32,49.32 52,44 47.25,44 46.35,44.9 IC1.17
D12/MISO
  Top 0.406: 58.47,36.53 U$14.SDO 58.42,35.12 58.42,37.15 56.83,38.73 56.83,42.23 56.06,43 45.5,43 43.81,44.69 IC1.18
D13/SCK
  Top 0.406: U$14.SCK 60.47,52.78 60,53.57 57.7,53.57 53.98,49.85 50.16,49.85 48.9,48.58 42.55,48.58 41.27,47.31 IC1.19
DIG1
  Top 0.406: U$14.ANT 70.47,54.47 ANT1.1
DS18B20
  Top 0.406: IC1.28 16,43.94 16,37.95 17.98,35.97 17.98,29.11 16.46,27.58 R7.1 | DS18B20.2 8.38,4.07 8.38,2.13 9.3,1.22 17.98,1.22 | 17.98,1.22 28.96,1.22 | 28.96,1.22 38.86,1.22 38.86,1.37 39.62,2.13 39.62,3.95 T4.2 | T3.2 29.11,3.94 29.11,1.98 28.96,1.83 28.96,1.22 | T2.2 18.75,4.09 18.75,1.98 17.98,1.22
  Bottom 0.406: DS18B20.2 8.3,12.11 16.46,20.27 R7.1
ESP_PUSH  (via drill 0.6)
  Top 0.305: U$1.3 78.72,18.41 v76.2,18.41 | v65.72,22.23 65.41,21.91 58.42,21.91 57.01,23.32 v44.2,23.32 | U$2.P$4 36.11,15.39 v41.6,20.88
  Top 0.406: U$2.P$3 U$2.P$4
  Bottom 0.305: v76.2,18.41 73.34,21.27 67.63,21.27 66.67,22.23 v65.72,22.23 | v41.6,20.88 44.04,23.32 v44.2,23.32
ESPRX
  Top 0.305: 74.89,27.3 78.61,27.3 79.76,28.45 81.03,28.45 81.79,27.69 81.79,10.92
  Top 0.406: 78.15,10.5 U$1.7 78.97,10.67 81.53,10.67 81.79,10.92 | TX.1 73.93,28.26 74.89,27.3 75.93,26.26 R6.1 R5.2
ESPTX
  Top 0.406: U$1.8 82.16,8.5 90.71,17.05 FTDI1.2 90.71,27.4 89.53,28.57 81.92,28.57 81.28,29.21 79.06,29.21 78.11,28.26 75.88,28.26 RX.1
GND  (via drill 0.5)
  Top 0.305: GPIO15.2 75.89,21.27 75.88,21.27 76.2,21.59 77.15,21.59 78.11,22.54 78.76,22.54 U$1.1
  Top 0.406: Q1.1 95,54.73 | 95,59 94.77,59.23 Q2.1 | 78.69,22.61 U$1.1 | C19.- 42.91,55.82 VDB3.1 | C12.- 30.8,55.82 VDB2.1 33.78,49.3 C3.2 | C11.- 19.81,54.61 VDB1.1 21.59,52.32 18.95,53.23 C13.- 17.85,53.09 14.92,53.09 14.54,52.7 VDB.1 14.39,52.67 14.5,52.56 | 33.43,48.95 C3.2 | C8.2 64.73,54.52 66.47,52.78 U$14.GND 66.47,50.27 66.36,50.16 66.36,49.85 66.99,49.21 71.44,49.21 72.39,48.26 72.39,37 U$14.P$12 | C7.2 C6.2 | DS18B20.1 5.08,4.43 5.08,6.35 6.03,7.3 | 6.03,7.3 9.84,7.3 | 9.84,7.3 13.97,7.3 | 13.97,7.3 24.77,7.3 | 24.77,7.3 35.24,7.3 36.2,6.35 36.2,4.24 T4.1 | T2.1 15.24,4.21 15.24,6.03 13.97,7.3 | T3.1 25.72,4.21 25.72,6.35 24.77,7.3 | 10.79,8.26 9.84,7.3 | 6.03,7.3 2,11.34 | JP4.1 77.47,67.97 | GPIO0.1 70.96,18.26 73.08,20.38 73.35,20.38 | 73.35,20.38 GPIO15.2 | R6.2 73.35,20.38 | IC1.22 33.48,46.53 C3.2 | RASPBERRYPI.10 57.79,63.77 58.72,63.77 59.75,64.8 59.75,67.25 58.75,68.25 53.55,68.25 52.63,67.33 RASPBERRYPI.5
  Top 0.559: 95,54.73 95,59 | FTDI1.6 80.55,24.25 U$1.1 | JP6.1 JP6.2 82.58,38.12 R14.1 R15.1 R16.1 94.77,49.06 Q1.1
  Bottom 0.406: 80.55,27.45 FTDI1.6 | VDB1.1 24.57,55.82 C12.- C19.- | IC1.8 36,38.47 | 36,38.47 36,41 33.66,43.34 IC1.22 | 36,38.47 37.47,37 37.47,33.97 35.56,32.07 C6.2 | GND.1 53.34,28.23 | 17.78,73.98 17.78,71.84 CT1.4 | 30.16,73.98 43.18,73.98 44.16,73 CT3.4 47.09,68.9 51.32,68.9 52.63,67.33 | 30.16,73.98 17.78,73.98 | CT2.4 31.11,71.89 31.11,73.03 30.16,73.98 | 52.63,67.33 RASPBERRYPI.5 | C8.2 58.72,63.77 RASPBERRYPI.10 | 17.78,73.98 17.77,73.98 | 77.47,47.05 77.5,47.08 | X1.3 55.5,70.2 52.63,67.33 | OK1.2 51.25,17.75
  Bottom 0.559: JP6.1 80.55,27.45 | R14.1 77.47,47.05 | T8.3 76.5,71.54 JP4.2 JP4.1 77.5,64.75 76.75,64 76.75,47.83 77.5,47.08
  other vias: 30.64,19.02 22,18 45,18 28,34 4.41,60.48 14.49,62.76 18,68 26,68 31,68 38,68 20,27 5,25 5,21 54,44 90,38 92.09,49.05 94.68,43.63 84.29,20 87.43,16.19 88,64 76.5,55 76.5,60.5 66.5,63.5 72.5,58 57.5,60.5 42.5,52.5 42.5,60.5 36.5,63 25,50 15,29.5 3.38,47.71 5,11 11.5,11 18,11 32.71,9.48 65.03,9.13 68.86,19.61 66,15 3,35.13 8.97,32.47 14.05,41.36 7.19,47.71 5.29,41.99 7.19,32.47
  pour Bottom (isolate 0.254): 0,0 38.61,-0.13 38.61,16.64 63.25,16.76 63.25,0 77.72,0 77.72,8.38 99.82,8.38 99.82,80.01 0,80.01
  pour Top (isolate 0.254): 0,0 38.48,0 38.48,16.76 63.25,16.76 63.25,0 77.72,0 77.72,8.38 99.82,8.38 99.82,80.01 0,80.01
N$1
  Top 0.406: C6.1 38.1,32.35 16MHZ.2 41.27,35.53 IC1.10
N$2
  Top 0.406: C12.+ 30.92,57.59 VDB2.2 | VDB2.2 VDT2.1 BUR2.1 | VDB2.2 28.33,65.91 CT2.5
N$3
  Bottom 0.406: FTDI1.1 93.25,25.75 81.75,14.25 C2.2
N$4
  Top 0.406: CT3.1 46.56,70.06 43.25,66.75 43.25,65 46.25,62 51.5,62 52.25,61.25 52.25,56.5 50.91,55.16 BUR3.2 52.45,52.9 <-CT3.1
N$5
  Bottom 0.406: R10.1 53.79,20.84
  Bottom 0.508: 53.79,20.84 OK1.1
N$6
  Bottom 0.813: OK1.6 54.8,9.18 T5.3
N$7
  Top 0.559: U1.4 11.62,45.87 C9.2
N$8
  Top 0.406: VDB3.2 VDT3.1 BUR3.1 | VDB3.2 42.91,57.59 C19.+ | CT3.5 41.46,64.89 VDB3.2
N$9
  Bottom 0.406: OK1.5 51.3,10.14
  Bottom 0.813: 51.3,10.14 T5.2
N$10
  Bottom 0.813: OK1.4 47.8,9.28 T5.1
N$11
  Top 0.559: R4.2 11.62,39.98 U1.3
N$12
  Top 0.406: IC1.9 38.73,38.07 35.58,34.91 16MHZ.1 30.51,29.84 C7.1
N$13
  Top 0.406: T1.1 87.81,61.09 R17.1
  Bottom 0.406: T1.1 92.23,71.61 94,73.38 T9.1
N$15
  Bottom 0.254: R20.1 58.8,3.26 LED.A
N$16
  Top 0.406: T1.3 94.77,65.23 95.5,64.5 95.5,63.41 Q2.2
  Bottom 0.406: Q2.2 93.5,58.5 93,58 92.5,58 90,55.5 90,51.91 R16.2
N$18
  Top 0.406: T1.2 93.5,63.5 93,63.5 90,60.5 90,56.5 | 90,56.5 88.5,55 R9.1 82.58,49.77 R14.2 | Q1.3 92,54.5 90,56.5
N$19
  Top 0.406: 35.97,48.95 C3.1 36.02,46.53 IC1.21
N$21
  Top 0.406: R15.2 85,49.45 85,49 83.5,47.5 81.5,47.5 80,49 80,49.53 R19.1
  Bottom 0.406: Q2.3 90.53,57.61 R11.1 86.11,57.62 85.11,56.62 R15.2
N$25
  Top 0.406: R18.1 93.47,52.53 93.5,52.5 Q1.2
N$26
  Top 0.406: U$1.2 76.91,20.5 GPIO15.1
N$29
  Top 0.406: U$1.4 74.58,16.5 GPIO0.2
N$34
  Top 0.406: R13.2 VDT.1 | VDB.2 14.39,58.3 C13.+
  Top 0.559: CN1.GNDBREAK 7.49,75.71 CN1.GND 12.45,72.15 12.45,62.27 VDB.2 VDT.1
N$36
  Bottom 0.305: FTDI1.3 88.17,24.99 87.31,24.13 69.59,24.13 R5.1
N$38
  Top 0.406: BUR1.1 VDT1.1 VDB1.2 | C11.+ 18,60.42 VDB1.2 | VDB1.2 15.12,66.92 CT1.5
N$39
  Top 0.406: CH_PD.2 95.24,25.44 92.81,23.01 92.81,13.69 94,12.5 U$1.11
N$40
  Top 0.305: U$1.9 94.86,8.64 84.07,8.64 82.55,7.11 77.47,7.11 76.96,7.62 76.96,8.92
  Top 0.406: 76.96,8.92 76.96,10.67 74.88,12.75 72.48,12.75 C2.1 66.56,18.67 R3.1
N$48  (via drill 0.5)
  other vias: 84,60
RESET
  Top 0.406: IC1.1 18.41,38.1 21.27,35.24 21.27,31.11 26.35,26.04 41.27,26.04 42.55,27.3 48.9,27.3 51.12,25.08 59.69,25.08 60.01,24.77 60.1,24.77 C1.1
  Bottom 0.406: R1.1 14.57,38.73 IC1.1

### Text on the board
tPlace: Designed in | North Wales | Made in UK | Open-Hardware
bValues: All:
_tsilk: GND RX TX | 3.3V PULSE | GND A3 A4 | 5V MBUS | HEATPUMP MONITOR v0.4 (NOV 2016) | An OpenEnergyMonitor project | Technology that helps us live within / ecological limits | Designed in / Snowdonia, North Wales / by Trystan Lea, / Glyn Hudson / & John Cantor | 6x DS18B20 TEMPERATURE SENSOR PORTS | GND DAT 3.3V | GND DAT 3.3V | GND DAT 3.3V | GND DAT 3.3V